# Altium schematic sheet MAIN.SchDoc
size A3; DocumentNumber: 1; SheetNumber: 1; SheetTotal: 9
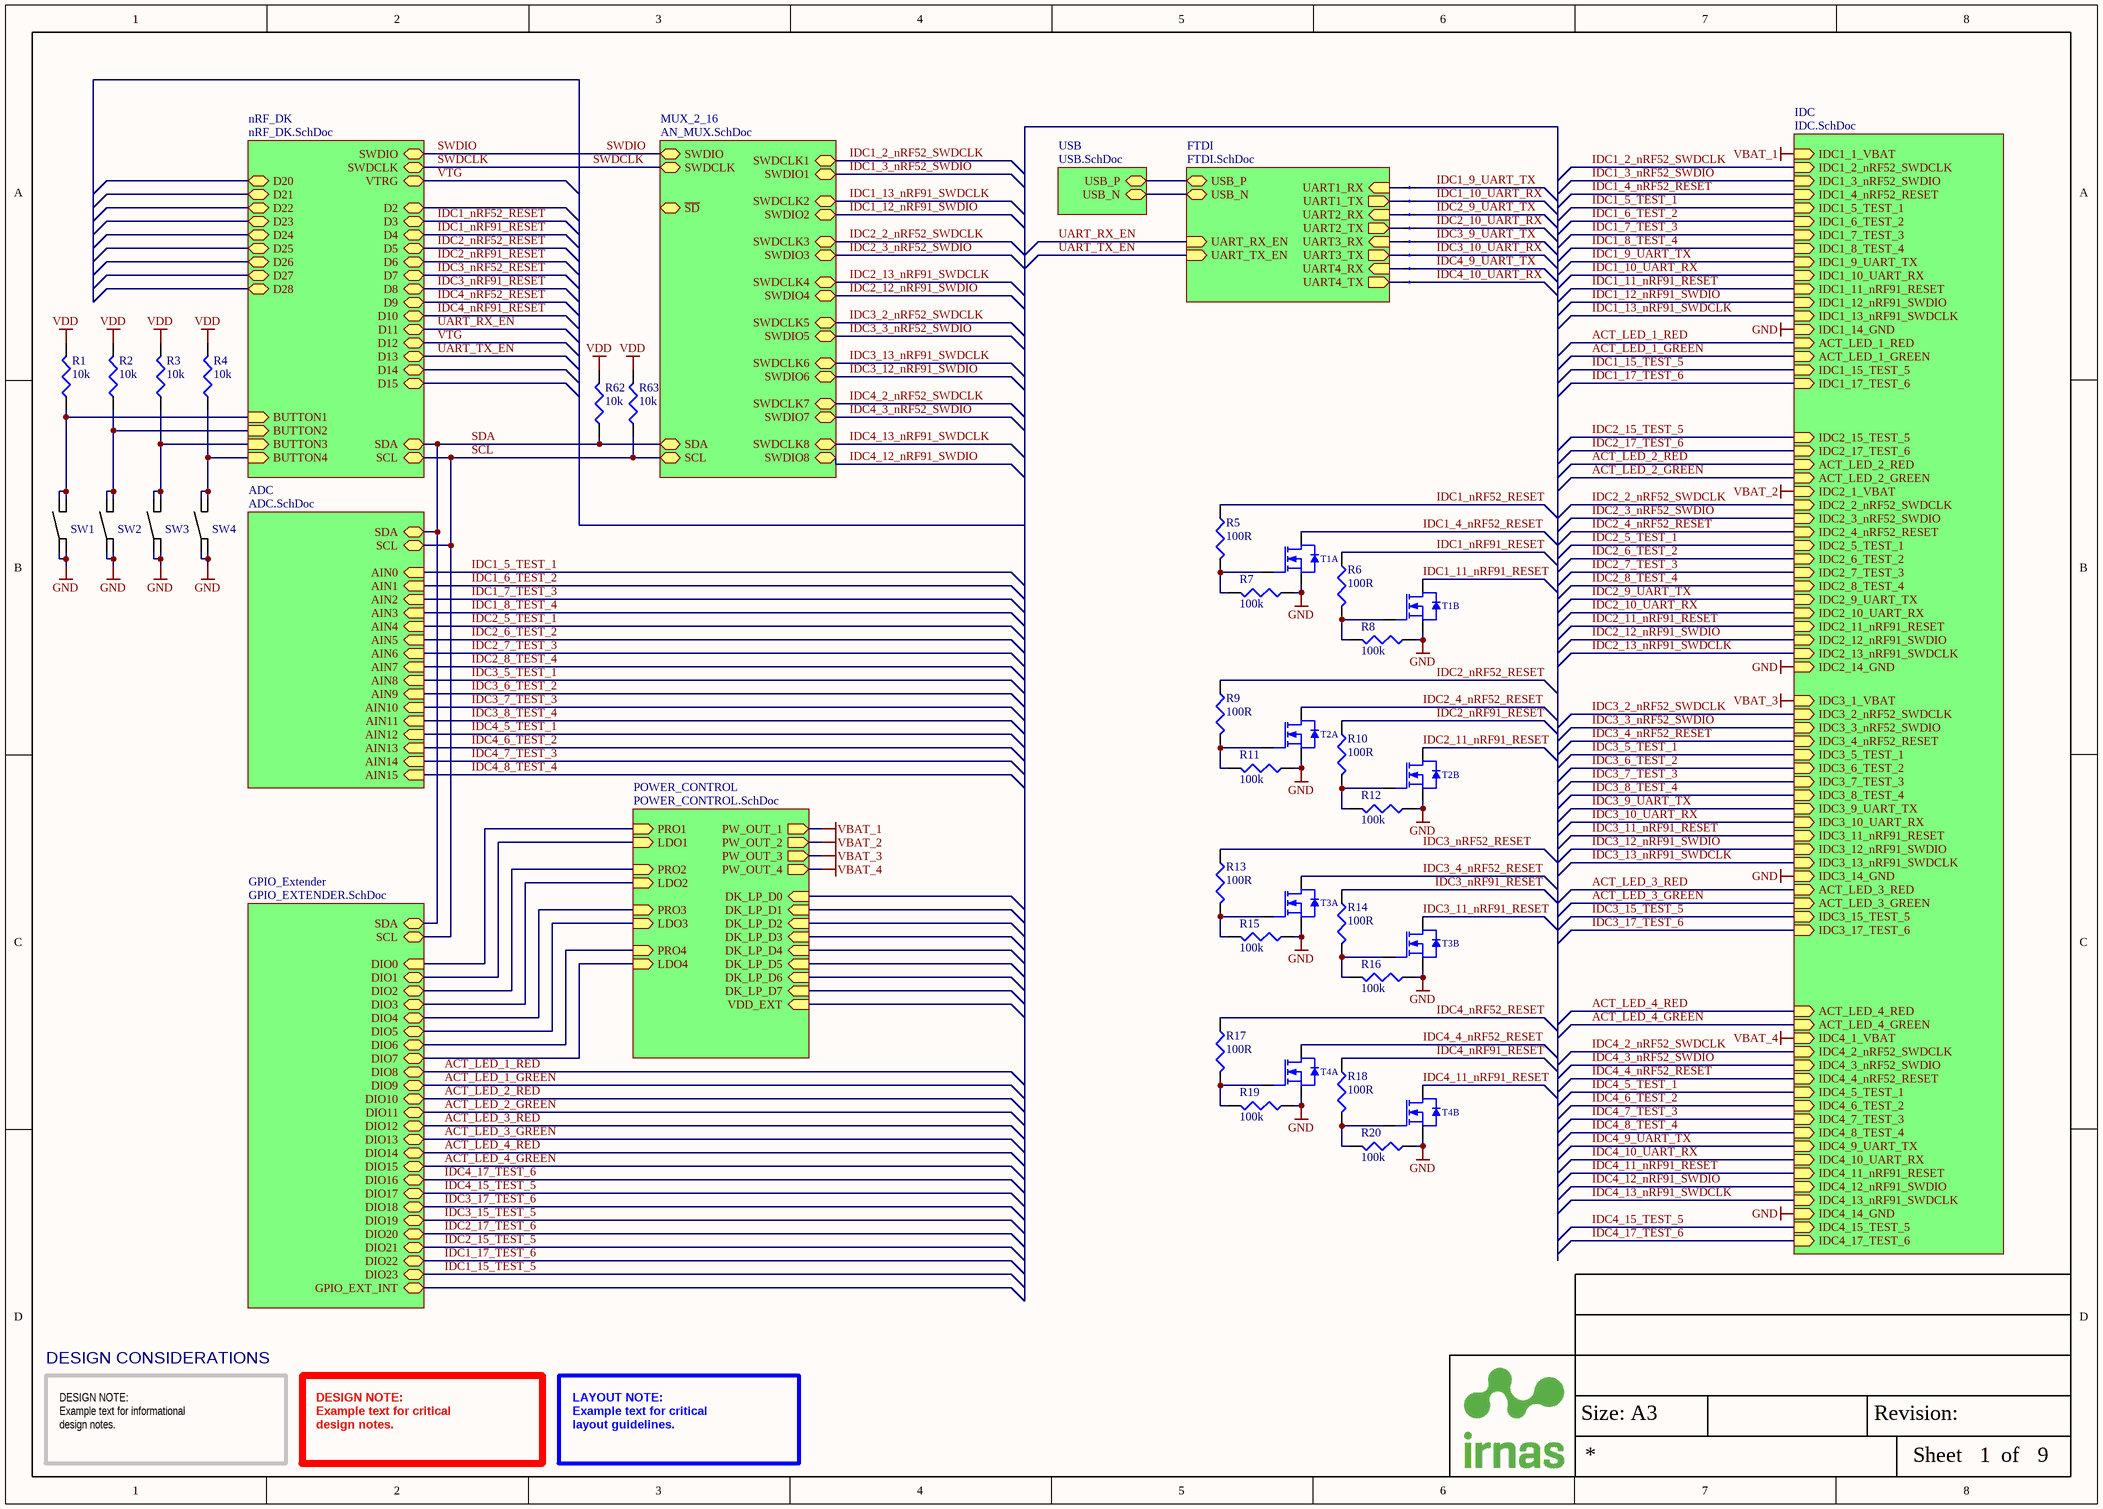
[diagram p0: MAIN.SchDoc]

## Parts
NT1  (no value)  [2 PIN STARPOINT]  (net tie, no BOM)
NT2  (no value)  [2 PIN STARPOINT]  (net tie, no BOM)
NT3  (no value)  [2 PIN STARPOINT]  (net tie, no BOM)
NT4  (no value)  [2 PIN STARPOINT]  (net tie, no BOM)
NT5  (no value)  [2 PIN STARPOINT]  (net tie, no BOM)
NT6  (no value)  [2 PIN STARPOINT]  (net tie, no BOM)
NT7  (no value)  [2 PIN STARPOINT]  (net tie, no BOM)
NT8  (no value)  [2 PIN STARPOINT]  (net tie, no BOM)
R1  10k  [RES0402]
R2  10k  [RES0402]
R3  10k  [RES0402]
R4  10k  [RES0402]
R5  100R  [RES0402]
R6  100R  [RES0402]
R7  100k  [RES0402]
R8  100k  [RES0402]
R9  100R  [RES0402]
R10  100R  [RES0402]
R11  100k  [RES0402]
R12  100k  [RES0402]
R13  100R  [RES0402]
R14  100R  [RES0402]
R15  100k  [RES0402]
R16  100k  [RES0402]
R17  100R  [RES0402]
R18  100R  [RES0402]
R19  100k  [RES0402]
R20  100k  [RES0402]
R62  10k  [RES0402]
R63  10k  [RES0402]
SW1  PTS645SL50-2 LFS  [Tactile Switch THT]  (value not drawn)
SW2  PTS645SL50-2 LFS  [Tactile Switch THT]  (value not drawn)
SW3  PTS645SL50-2 LFS  [Tactile Switch THT]  (value not drawn)
SW4  PTS645SL50-2 LFS  [Tactile Switch THT]  (value not drawn)
T1  NTZD3154NT1G  [SOT-563]  (value not drawn)  (parts A,B of 2)
T2  NTZD3154NT1G  [SOT-563]  (value not drawn)  (parts A,B of 2)
T3  NTZD3154NT1G  [SOT-563]  (value not drawn)  (parts A,B of 2)
T4  NTZD3154NT1G  [SOT-563]  (value not drawn)  (parts A,B of 2)

## Sub-sheets
ADC = ADC.SchDoc: AIN0 (in), AIN1 (in), AIN2 (in), AIN3 (in), AIN4 (in), AIN5 (in), AIN6 (in), AIN7 (in), SCL (bidir), SDA (bidir), AIN8 (in), AIN9 (in), AIN10 (in), AIN11 (in), AIN12 (in), AIN13 (in), AIN14 (in), AIN15 (in)
FTDI = FTDI.SchDoc: UART1_RX (in), UART1_TX (out), UART2_RX (in), UART2_TX (out), UART3_RX (in), UART3_TX (out), UART4_RX (in), UART4_TX (out), USB_P (bidir), USB_N (bidir), UART_RX_EN (in), UART_TX_EN (in)
GPIO_Extender = GPIO_EXTENDER.SchDoc: DIO1 (bidir), DIO2 (bidir), DIO3 (bidir), DIO4 (bidir), DIO5 (bidir), DIO6 (bidir), DIO7 (bidir), DIO8 (bidir), DIO9 (bidir), DIO10 (bidir), DIO11 (bidir), DIO12 (bidir), DIO13 (bidir), DIO14 (bidir), DIO15 (bidir), SDA (bidir), SCL (bidir), DIO0 (in), DIO17 (bidir), GPIO_EXT_INT (bidir), DIO20 (bidir), DIO22 (bidir), DIO23 (bidir), DIO18 (bidir), DIO16 (bidir), DIO21 (bidir), DIO19 (bidir)
IDC = IDC.SchDoc: IDC1_1_VBAT (in), IDC1_2_nRF52_SWDCLK (in), IDC1_3_nRF52_SWDIO (in), IDC1_4_nRF52_RESET (in), IDC1_5_TEST_1 (in), IDC1_6_TEST_2 (in), IDC1_7_TEST_3 (in), IDC1_8_TEST_4 (in), IDC1_9_UART_TX (in), IDC1_10_UART_RX (in), IDC1_11_nRF91_RESET (in), IDC1_12_nRF91_SWDIO (in), IDC1_13_nRF91_SWDCLK (in), IDC1_14_GND (in), IDC2_1_VBAT (in), IDC2_2_nRF52_SWDCLK (in), IDC2_3_nRF52_SWDIO (in), IDC2_4_nRF52_RESET (in), IDC2_5_TEST_1 (in), IDC2_6_TEST_2 (in), IDC2_7_TEST_3 (in), IDC2_8_TEST_4 (in), IDC2_9_UART_TX (in), IDC2_10_UART_RX (in), IDC2_11_nRF91_RESET (in), IDC2_12_nRF91_SWDIO (in), IDC2_13_nRF91_SWDCLK (in), IDC2_14_GND (in), IDC3_1_VBAT (in), IDC3_2_nRF52_SWDCLK (in), IDC3_3_nRF52_SWDIO (in), IDC3_4_nRF52_RESET (in), IDC3_5_TEST_1 (in), IDC3_6_TEST_2 (in), IDC3_7_TEST_3 (in), IDC3_8_TEST_4 (in), IDC3_9_UART_TX (in), IDC3_10_UART_RX (in), IDC3_11_nRF91_RESET (in), IDC3_12_nRF91_SWDIO (in), IDC3_13_nRF91_SWDCLK (in), IDC3_14_GND (in), IDC4_1_VBAT (in), IDC4_2_nRF52_SWDCLK (in), IDC4_3_nRF52_SWDIO (in), IDC4_4_nRF52_RESET (in), IDC4_5_TEST_1 (in), IDC4_6_TEST_2 (in), IDC4_7_TEST_3 (in), IDC4_8_TEST_4 (in), IDC4_9_UART_TX (in), IDC4_10_UART_RX (in), IDC4_11_nRF91_RESET (in), IDC4_12_nRF91_SWDIO (in), IDC4_13_nRF91_SWDCLK (in), IDC4_14_GND (in), ACT_LED_1_RED (in), ACT_LED_1_GREEN (in), ACT_LED_2_RED (in), ACT_LED_2_GREEN (in), ACT_LED_3_RED (in), ACT_LED_3_GREEN (in), ACT_LED_4_RED (in), ACT_LED_4_GREEN (in), IDC2_17_TEST_6 (in), IDC3_15_TEST_5 (in), IDC3_17_TEST_6 (in), IDC1_17_TEST_6 (in), IDC1_15_TEST_5 (in), IDC4_17_TEST_6 (in), IDC2_15_TEST_5 (in), IDC4_15_TEST_5 (in)
MUX_2_16 = AN_MUX.SchDoc: SWDIO (bidir), SWDCLK (bidir), SWDIO1 (bidir), SWDIO2 (bidir), SWDIO3 (bidir), SWDIO4 (bidir), SWDIO5 (bidir), SWDIO6 (bidir), SWDIO7 (bidir), SWDIO8 (bidir), SWDCLK1 (bidir), SWDCLK2 (bidir), SWDCLK3 (bidir), SWDCLK4 (bidir), SWDCLK5 (bidir), SWDCLK6 (bidir), SWDCLK7 (bidir), SWDCLK8 (bidir), SDA (bidir), SCL (bidir), ~{SD} (bidir)
nRF_DK = nRF_DK.SchDoc: SWDIO (bidir), SWDCLK (bidir), VTRG (bidir), BUTTON1 (in), BUTTON2 (in), BUTTON3 (in), BUTTON4 (in), SDA (bidir), SCL (bidir), D23 (bidir), D25 (bidir), D4 (bidir), D8 (bidir), D15 (bidir), D5 (bidir), D6 (bidir), D21 (bidir), D12 (bidir), D3 (bidir), D27 (bidir), D22 (bidir), D9 (bidir), D11 (bidir), D14 (bidir), D13 (bidir), D2 (bidir), D7 (bidir), D24 (bidir), D26 (bidir), D28 (bidir), D20 (bidir), D10 (bidir)
POWER_CONTROL = POWER_CONTROL.SchDoc: PW_OUT_1 (out), PW_OUT_2 (out), PW_OUT_3 (out), PW_OUT_4 (out), PRO1 (in), LDO1 (in), LDO2 (in), LDO3 (in), LDO4 (in), PRO2 (in), PRO3 (in), PRO4 (in), VDD_EXT (in), DK_LP_D5 (in), DK_LP_D7 (in), DK_LP_D1 (in), DK_LP_D4 (in), DK_LP_D0 (in), DK_LP_D3 (in), DK_LP_D6 (in), DK_LP_D2 (in)
USB = USB.SchDoc: USB_P (bidir), USB_N (bidir)

## Nets
GND: R7.1 R8.1 R11.1 R12.1 R15.1 R16.1 R19.1 R20.1 SW1.1 SW1.2 SW2.1 SW2.2 SW3.1 SW3.2 SW4.1 SW4.2 T1.1(S1) T1.4(S2) T2.1(S1) T2.4(S2) T3.1(S1) T3.4(S2) T4.1(S1) T4.4(S2) ; sheet IDC/IDC1_14_GND, sheet IDC/IDC2_14_GND, sheet IDC/IDC3_14_GND, sheet IDC/IDC4_14_GND
VBAT_1: sheet POWER_CONTROL/PW_OUT_1, sheet IDC/IDC1_1_VBAT
VBAT_2: sheet POWER_CONTROL/PW_OUT_2, sheet IDC/IDC2_1_VBAT
VBAT_3: sheet POWER_CONTROL/PW_OUT_3, sheet IDC/IDC3_1_VBAT
VBAT_4: sheet POWER_CONTROL/PW_OUT_4, sheet IDC/IDC4_1_VBAT
VDD: R1.2 R2.2 R3.2 R4.2 R62.2 R63.2
ACT_LED_1_GREEN: sheet GPIO_Extender/DIO9, sheet IDC/ACT_LED_1_GREEN
ACT_LED_1_RED: sheet GPIO_Extender/DIO8, sheet IDC/ACT_LED_1_RED
ACT_LED_2_GREEN: sheet GPIO_Extender/DIO11, sheet IDC/ACT_LED_2_GREEN
ACT_LED_2_RED: sheet GPIO_Extender/DIO10, sheet IDC/ACT_LED_2_RED
ACT_LED_3_GREEN: sheet GPIO_Extender/DIO13, sheet IDC/ACT_LED_3_GREEN
ACT_LED_3_RED: sheet GPIO_Extender/DIO12, sheet IDC/ACT_LED_3_RED
ACT_LED_4_GREEN: sheet GPIO_Extender/DIO15, sheet IDC/ACT_LED_4_GREEN
ACT_LED_4_RED: sheet GPIO_Extender/DIO14, sheet IDC/ACT_LED_4_RED
IDC1_2_nRF52_SWDCLK: sheet MUX_2_16/SWDCLK1, sheet IDC/IDC1_2_nRF52_SWDCLK
IDC1_3_nRF52_SWDIO: sheet MUX_2_16/SWDIO1, sheet IDC/IDC1_3_nRF52_SWDIO
IDC1_4_nRF52_RESET: T1.6(D1) ; sheet IDC/IDC1_4_nRF52_RESET
IDC1_5_TEST_1: sheet ADC/AIN0, sheet IDC/IDC1_5_TEST_1
IDC1_6_TEST_2: sheet ADC/AIN1, sheet IDC/IDC1_6_TEST_2
IDC1_7_TEST_3: sheet ADC/AIN2, sheet IDC/IDC1_7_TEST_3
IDC1_8_TEST_4: sheet ADC/AIN3, sheet IDC/IDC1_8_TEST_4
IDC1_9_UART_TX: NT1.2 ; sheet IDC/IDC1_9_UART_TX
IDC1_10_UART_RX: NT2.2 ; sheet IDC/IDC1_10_UART_RX
IDC1_11_nRF91_RESET: T1.3(D2) ; sheet IDC/IDC1_11_nRF91_RESET
IDC1_12_nRF91_SWDIO: sheet MUX_2_16/SWDIO2, sheet IDC/IDC1_12_nRF91_SWDIO
IDC1_13_nRF91_SWDCLK: sheet MUX_2_16/SWDCLK2, sheet IDC/IDC1_13_nRF91_SWDCLK
IDC1_15_TEST_5: sheet GPIO_Extender/DIO23, sheet IDC/IDC1_15_TEST_5
IDC1_17_TEST_6: sheet GPIO_Extender/DIO22, sheet IDC/IDC1_17_TEST_6
IDC1_nRF52_RESET: R5.1 ; sheet nRF_DK/D3
IDC1_nRF91_RESET: R6.1 ; sheet nRF_DK/D4
IDC2_2_nRF52_SWDCLK: sheet MUX_2_16/SWDCLK3, sheet IDC/IDC2_2_nRF52_SWDCLK
IDC2_3_nRF52_SWDIO: sheet MUX_2_16/SWDIO3, sheet IDC/IDC2_3_nRF52_SWDIO
IDC2_4_nRF52_RESET: T2.6(D1) ; sheet IDC/IDC2_4_nRF52_RESET
IDC2_5_TEST_1: sheet ADC/AIN4, sheet IDC/IDC2_5_TEST_1
IDC2_6_TEST_2: sheet ADC/AIN5, sheet IDC/IDC2_6_TEST_2
IDC2_7_TEST_3: sheet ADC/AIN6, sheet IDC/IDC2_7_TEST_3
IDC2_8_TEST_4: sheet ADC/AIN7, sheet IDC/IDC2_8_TEST_4
IDC2_9_UART_TX: NT3.2 ; sheet IDC/IDC2_9_UART_TX
IDC2_10_UART_RX: NT4.2 ; sheet IDC/IDC2_10_UART_RX
IDC2_11_nRF91_RESET: T2.3(D2) ; sheet IDC/IDC2_11_nRF91_RESET
IDC2_12_nRF91_SWDIO: sheet MUX_2_16/SWDIO4, sheet IDC/IDC2_12_nRF91_SWDIO
IDC2_13_nRF91_SWDCLK: sheet MUX_2_16/SWDCLK4, sheet IDC/IDC2_13_nRF91_SWDCLK
IDC2_15_TEST_5: sheet GPIO_Extender/DIO21, sheet IDC/IDC2_15_TEST_5
IDC2_17_TEST_6: sheet GPIO_Extender/DIO20, sheet IDC/IDC2_17_TEST_6
IDC2_nRF52_RESET: R9.1 ; sheet nRF_DK/D5
IDC2_nRF91_RESET: R10.1 ; sheet nRF_DK/D6
IDC3_2_nRF52_SWDCLK: sheet MUX_2_16/SWDCLK5, sheet IDC/IDC3_2_nRF52_SWDCLK
IDC3_3_nRF52_SWDIO: sheet MUX_2_16/SWDIO5, sheet IDC/IDC3_3_nRF52_SWDIO
IDC3_4_nRF52_RESET: T3.6(D1) ; sheet IDC/IDC3_4_nRF52_RESET
IDC3_5_TEST_1: sheet ADC/AIN8, sheet IDC/IDC3_5_TEST_1
IDC3_6_TEST_2: sheet ADC/AIN9, sheet IDC/IDC3_6_TEST_2
IDC3_7_TEST_3: sheet ADC/AIN10, sheet IDC/IDC3_7_TEST_3
IDC3_8_TEST_4: sheet ADC/AIN11, sheet IDC/IDC3_8_TEST_4
IDC3_9_UART_TX: NT5.2 ; sheet IDC/IDC3_9_UART_TX
IDC3_10_UART_RX: NT6.2 ; sheet IDC/IDC3_10_UART_RX
IDC3_11_nRF91_RESET: T3.3(D2) ; sheet IDC/IDC3_11_nRF91_RESET
IDC3_12_nRF91_SWDIO: sheet MUX_2_16/SWDIO6, sheet IDC/IDC3_12_nRF91_SWDIO
IDC3_13_nRF91_SWDCLK: sheet MUX_2_16/SWDCLK6, sheet IDC/IDC3_13_nRF91_SWDCLK
IDC3_15_TEST_5: sheet GPIO_Extender/DIO19, sheet IDC/IDC3_15_TEST_5
IDC3_17_TEST_6: sheet GPIO_Extender/DIO18, sheet IDC/IDC3_17_TEST_6
IDC3_nRF52_RESET: R13.1 ; sheet nRF_DK/D7
IDC3_nRF91_RESET: R14.1 ; sheet nRF_DK/D8
IDC4_2_nRF52_SWDCLK: sheet MUX_2_16/SWDCLK7, sheet IDC/IDC4_2_nRF52_SWDCLK
IDC4_3_nRF52_SWDIO: sheet MUX_2_16/SWDIO7, sheet IDC/IDC4_3_nRF52_SWDIO
IDC4_4_nRF52_RESET: T4.6(D1) ; sheet IDC/IDC4_4_nRF52_RESET
IDC4_5_TEST_1: sheet ADC/AIN12, sheet IDC/IDC4_5_TEST_1
IDC4_6_TEST_2: sheet ADC/AIN13, sheet IDC/IDC4_6_TEST_2
IDC4_7_TEST_3: sheet ADC/AIN14, sheet IDC/IDC4_7_TEST_3
IDC4_8_TEST_4: sheet ADC/AIN15, sheet IDC/IDC4_8_TEST_4
IDC4_9_UART_TX: NT7.2 ; sheet IDC/IDC4_9_UART_TX
IDC4_10_UART_RX: NT8.2 ; sheet IDC/IDC4_10_UART_RX
IDC4_11_nRF91_RESET: T4.3(D2) ; sheet IDC/IDC4_11_nRF91_RESET
IDC4_12_nRF91_SWDIO: sheet MUX_2_16/SWDIO8, sheet IDC/IDC4_12_nRF91_SWDIO
IDC4_13_nRF91_SWDCLK: sheet MUX_2_16/SWDCLK8, sheet IDC/IDC4_13_nRF91_SWDCLK
IDC4_15_TEST_5: sheet GPIO_Extender/DIO17, sheet IDC/IDC4_15_TEST_5
IDC4_17_TEST_6: sheet GPIO_Extender/DIO16, sheet IDC/IDC4_17_TEST_6
IDC4_nRF52_RESET: R17.1 ; sheet nRF_DK/D9
IDC4_nRF91_RESET: R18.1 ; sheet nRF_DK/D10
SCL: R63.1 ; sheet nRF_DK/SCL, sheet ADC/SCL, sheet MUX_2_16/SCL, sheet GPIO_Extender/SCL
SDA: R62.1 ; sheet nRF_DK/SDA, sheet ADC/SDA, sheet MUX_2_16/SDA, sheet GPIO_Extender/SDA
SWDCLK: sheet nRF_DK/SWDCLK, sheet MUX_2_16/SWDCLK
SWDIO: sheet nRF_DK/SWDIO, sheet MUX_2_16/SWDIO
UART_RX_EN: sheet nRF_DK/D11, sheet FTDI/UART_RX_EN
UART_TX_EN: sheet nRF_DK/D13, sheet FTDI/UART_TX_EN
VTG: sheet nRF_DK/VTRG, sheet nRF_DK/D12
NetNT1_1: NT1.1 ; sheet FTDI/UART1_RX
NetNT2_1: NT2.1 ; sheet FTDI/UART1_TX
NetNT3_1: NT3.1 ; sheet FTDI/UART2_RX
NetNT4_1: NT4.1 ; sheet FTDI/UART2_TX
NetNT5_1: NT5.1 ; sheet FTDI/UART3_RX
NetNT6_1: NT6.1 ; sheet FTDI/UART3_TX
NetNT7_1: NT7.1 ; sheet FTDI/UART4_RX
NetNT8_1: NT8.1 ; sheet FTDI/UART4_TX
NetR1_1: R1.1 SW1.3 SW1.4 ; sheet nRF_DK/BUTTON1
NetR2_1: R2.1 SW2.3 SW2.4 ; sheet nRF_DK/BUTTON2
NetR3_1: R3.1 SW3.3 SW3.4 ; sheet nRF_DK/BUTTON3
NetR4_1: R4.1 SW4.3 SW4.4 ; sheet nRF_DK/BUTTON4
NetR5_2: R5.2 R7.2 T1.2(G1)
NetR6_2: R6.2 R8.2 T1.5(G2)
NetR9_2: R9.2 R11.2 T2.2(G1)
NetR10_2: R10.2 R12.2 T2.5(G2)
NetR13_2: R13.2 R15.2 T3.2(G1)
NetR14_2: R14.2 R16.2 T3.5(G2)
NetR17_2: R17.2 R19.2 T4.2(G1)
NetR18_2: R18.2 R20.2 T4.5(G2)
(unnamed): sheet GPIO_Extender/DIO1, sheet POWER_CONTROL/LDO1
(unnamed): sheet GPIO_Extender/DIO2, sheet POWER_CONTROL/PRO2
(unnamed): sheet GPIO_Extender/DIO3, sheet POWER_CONTROL/LDO2
(unnamed): sheet GPIO_Extender/DIO4, sheet POWER_CONTROL/PRO3
(unnamed): sheet GPIO_Extender/DIO5, sheet POWER_CONTROL/LDO3
(unnamed): sheet GPIO_Extender/DIO6, sheet POWER_CONTROL/PRO4
(unnamed): sheet GPIO_Extender/DIO7, sheet POWER_CONTROL/LDO4
(unnamed): sheet GPIO_Extender/DIO0, sheet POWER_CONTROL/PRO1
(unnamed): sheet FTDI/USB_P, sheet USB/USB_P
(unnamed): sheet FTDI/USB_N, sheet USB/USB_N

## Notes on the sheet
- DESIGN CONSIDERATIONS
- DESIGN NOTE:
  Example text for informational
  design notes.
- DESIGN NOTE:
  Example text for critical
  design notes.
- LAYOUT NOTE:
  Example text for critical
  layout guidelines.
- Size: A3
- Revision:
- Sheet
- of

## Library data of the parts
NT1-NT8 = NetTie: Starpoint
R1-R4 R62 R63 = R - 10k/0402: MULTICOMP         MCWR04X1002FTL             SMD Chip Resistor, Thick Film, 10 kohm, 50 V, 0402 [1005 Metric], 62.5 mW,  1%, MCWR Series; IRNAS Part No.: I-100014; Resistance: 10kR; Voltage Rating: 50V; Power Rating: 62.5mW; Temperature Coefficient: 100ppm/°C; Supplier 1: Farnell; Manufacturer: Multicomp; Manufacturer Part Number: MCWR04X1002FTL; Stock 1: 602609; Pricing 1: 10=0.0029, 100=0.0017, 500=0.0012, 2500=0.001, 5000=0.0008 (EUR); Case/Package: 0402; Case Code (Metric): 1005; Case Code (Imperial): 0402; Packaging: Cut Tape; Composition: Thick Film; Tolerance: 1%; Voltage Rating (DC): 50V; REACH SVHC: No SVHC; ComponentLink1URL: http://www.farnell.com/datasheets/1849611.pdf; ComponentLink1Description: http://www.farnell.com/datasheets/1849611.pdf; Supplier Part Number 1: 2447096
R5 R6 R9 R10 R13 R14 R17 R18 = R - 100R/0402: MULTICOMP         MCMR04X1000FTL            SMD Chip Resistor, Ceramic, MCMR Series, 100 ohm, 50 V, 0402 [1005 Metric], 62.5 mW,  1%; IRNAS Part No.: /; Temperature Coefficient: 100ppm/°C; Power Rating: 62.5mW; Voltage Rating: 50V; Supplier 1: Farnell; Manufacturer: Multicomp; Manufacturer Part Number: MCMR04X1000FTL; Stock 1: 62365; Pricing 1: 10=0.0071, 100=0.0042, 500=0.003, 2500=0.0024, 5000=0.0019 (GBP); Case/Package: 0402; Case Code (Metric): 1005; Case Code (Imperial): 0402; Resistance: 100R; Tolerance: 1%; Composition: Ceramic; Packaging: Cut Tape; Voltage Rating (DC): 50V; REACH SVHC: No SVHC; ComponentLink1URL: https://datasheet.ciiva.com/28692/1716705-28692087.pdf; ComponentLink1Description: https://datasheet.ciiva.com/28692/1716705-28692087.pdf; ComponentLink2URL: https://datasheet.ciiva.com/22708/1716705-22708156.pdf; ComponentLink2Description: https://datasheet.ciiva.com/22708/1716705-22708156.pdf; Supplier Part Number 1: 2072515
R7 R8 R11 R12 R15 R16 R19 R20 = R - 100k/0402: MULTICOMP   MCWR04X1003FTL   RES, THICK FILM, 100KOHM, 1%, 0.0625W; IRNAS Part No.: I-100013; Resistance: 100kR; Power Rating: 62.5mW; Voltage Rating: 50V; Temperature Coefficient: 100ppm/°C; Supplier 1: Farnell; Manufacturer: Multicomp; Manufacturer Part Number: MCWR04X1003FTL; Stock 1: 161188; Pricing 1: 10=0.0029, 100=0.0017, 500=0.0012, 2500=0.001, 5000=0.0008 (EUR); Mount: Surface Mount; Case/Package: 0402; Case Code (Metric): 1005; Case Code (Imperial): 0402; Tolerance: 1%; Packaging: Cut Tape; Composition: Thick Film; Voltage Rating (DC): 50V; REACH SVHC: No SVHC; ComponentLink1URL: https://datasheet.ciiva.com/46386/1849611-46386524.pdf; ComponentLink1Description: https://datasheet.ciiva.com/46386/1849611-46386524.pdf; Supplier Part Number 1: 2447094
SW1-SW4 = SW - PTS645SL50-2 LFS: Tactile Switch, PT645 Series, Top Actuated, Through Hole, Round Button, 130 gf, 50mA at 12VDC; Manufacturer: C&K; Number of Circuits: 3; Max Voltage Rating (DC): 24V; Throw Configuration: SPST; Insulation Resistance: 100MR; Manufacturer Part Number: PTS645SL50-2 LFS; Stock 1: 20221; Pricing 1: 5 = 1.32000, 25 = 1.07000, 100 = 0.76000, 150 = 0.68000, 250 = 0.60600, 1000 = 0.51000 (EUR); RoHS: Yes; REACH SVHC: Unknown; Flammability Rating: UL94 V-0; ComponentLink1URL: http://www.farnell.com/datasheets/2789831.pdf?_ga=2.4891187.1885680894.1564390817-1373726713.1554121096&_gac=1.58261848.1562763802.CjwKCAjwmZbpBRAGEiwADrmVXm8xT8OHDZvJe8qZIQyyGmIuiUD-TEITatw0hIdDkyBwIXXCH7oneRoCl7cQAvD_BwE; ComponentLink1Description: Datasheet; Supplier 1: Farnell; Supplier Part Number 1: 2435162
T1-T4 = T_M - NTZD3154NT1G: Dual MOSFET, Dual N Channel, 540 mA, 20 V, 0.4 ohm, 4.5 V, 1 V; ELRAD Id sifra / ELRAD Id No: 597778; Opis / Description: MOSFET BSS123       /N-Channel; Komp / Device: SMD; Value: BSS123; Velikost / Size: SOT23; FIT: 0.44; Author: Ciril Golob; Date: 11.07.2018; ComponentLINK1Description: Datasheet; ComponentLINK2Description: Datasheet www; ComponentLINK1URL: c:\ELRADSVN\Altium_Library\Libraries\Active\Datasheet\BSS123.pdf; ComponentLINK2URL: http://www.onsemi.com/pub/Collateral/BSS123-D.PDF